# Altium schematic sheet CW308T_S6LX9_FPGAIO.SchDoc: FPGA I/O Pins, Configuration
size Letter; Organization: NewAE Technology Inc.; Address1: 1083 Queen St., Suite 196; Address2: Halifax; Address3: NS; Address4: Canada B3H 0B2; SheetNumber: 3; SheetTotal: 3; SheetApproved: Yes
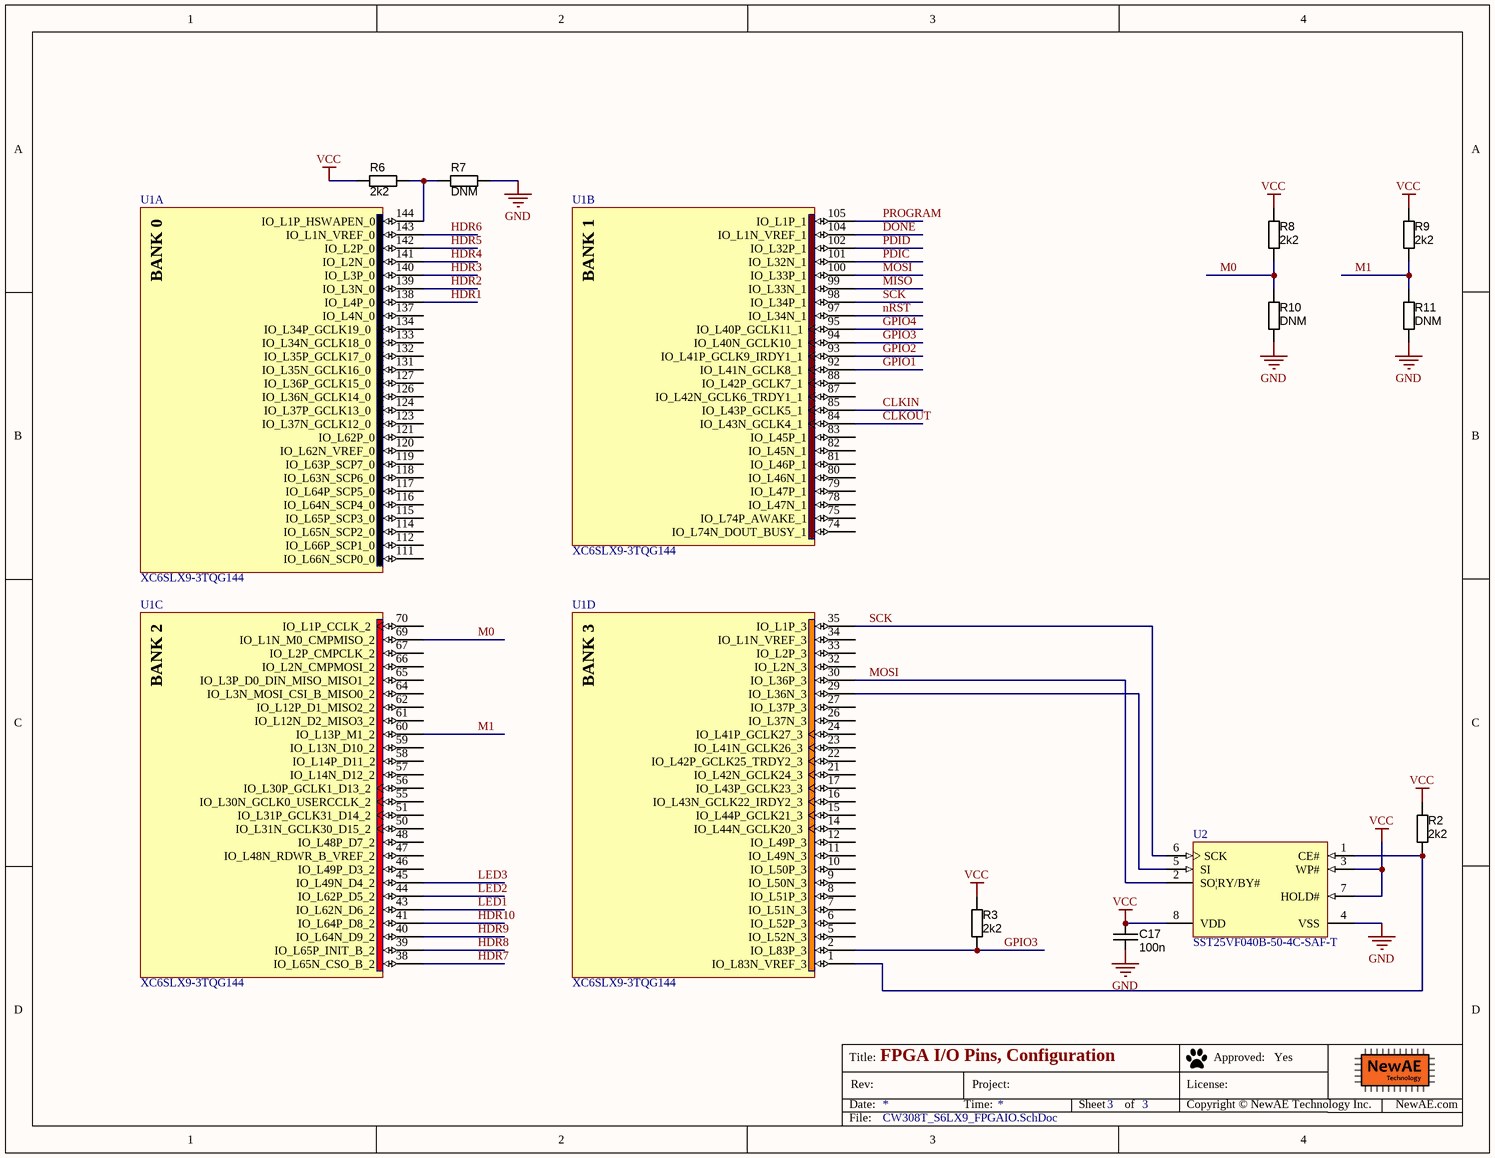
[diagram p0: CW308T_S6LX9_FPGAIO.SchDoc]

## Parts
(Parts that share a designator on the sheet are numbered #1, #2 ... from top to bottom, then left to right.)
C17  value 100n  [CAPC1608X90N]  (hidden comment: approved sub OK)
R2  value 2k2  [RESC1608X55N]  (hidden comment: Thick Film)
R3  value 2k2  [RESC1608X55N]  (hidden comment: Thick Film)
R6  value 2k2  [RESC1608X55N]  (hidden comment: Thick Film)
R7  value DNM  [RESC1608X55N]  (hidden comment: Thick Film)
R8  value 2k2  [RESC1608X55N]  (hidden comment: Thick Film)
R9  value 2k2  [RESC1608X55N]  (hidden comment: Thick Film)
R10  value DNM  [RESC1608X55N]  (hidden comment: Thick Film)
R11  value DNM  [RESC1608X55N]  (hidden comment: Thick Film)
U1#1  XC6SLX9-3TQG144  [TQG144_L]  (parts A,C,D of 7)
U1#2  XC6SLX9-3TQG144  [TQG144_L]  (part B of 7)
U2  SST25VF040B-50-4C-SAF-T  [MCHP-SOIC-SA8_N]

## Nets
GND: C17.2 R7.2 R10.1 R11.1 U2.4(VSS)
VCC: C17.1 R2.1 R3.1 R6.1 R8.2 R9.2 U2.3(WP#) U2.7(HOLD#) U2.8(VDD)
CLKIN: U1#2.85(IO_L43P_GCLK5_1)
CLKOUT: U1#2.84(IO_L43N_GCLK4_1)
DONE: U1#2.104(IO_L1N_VREF_1)
GPIO1: U1#2.92(IO_L41N_GCLK8_1)
GPIO2: U1#2.93(IO_L41P_GCLK9_IRDY1_1)
GPIO3: R3.2 U1#1.2(IO_L83P_3) U1#2.94(IO_L40N_GCLK10_1)
GPIO4: U1#2.95(IO_L40P_GCLK11_1)
HDR1: U1#1.138(IO_L4P_0)
HDR2: U1#1.139(IO_L3N_0)
HDR3: U1#1.140(IO_L3P_0)
HDR4: U1#1.141(IO_L2N_0)
HDR5: U1#1.142(IO_L2P_0)
HDR6: U1#1.143(IO_L1N_VREF_0)
HDR7: U1#1.38(IO_L65N_CSO_B_2)
HDR8: U1#1.39(IO_L65P_INIT_B_2)
HDR9: U1#1.40(IO_L64N_D9_2)
HDR10: U1#1.41(IO_L64P_D8_2)
LED1: U1#1.43(IO_L62N_D6_2)
LED2: U1#1.44(IO_L62P_D5_2)
LED3: U1#1.45(IO_L49N_D4_2)
M0: R8.1 R10.2 U1#1.69(IO_L1N_M0_CMPMISO_2)
M1: R9.1 R11.2 U1#1.60(IO_L13P_M1_2)
MISO: U1#2.99(IO_L33N_1)
MOSI: U1#1.30(IO_L36P_3) U1#2.100(IO_L33P_1) U2.2(SO|RY/BY#)
nRST: U1#2.97(IO_L34N_1)
PDIC: U1#2.101(IO_L32N_1)
PDID: U1#2.102(IO_L32P_1)
PROGRAM: U1#2.105(IO_L1P_1)
SCK: U1#1.35(IO_L1P_3) U1#2.98(IO_L34P_1) U2.6(SCK)
NetR2_2: R2.2 U1#1.1(IO_L83N_VREF_3) U2.1(CE#)
NetR6_2: R6.2 R7.1 U1#1.144(IO_L1P_HSWAPEN_0)
NetU1#1_29: U1#1.29(IO_L36N_3) U2.5(SI)

Not connected (* = marked no-connect by the designer): U1#1 5(IO_L52N_3) 6(IO_L52P_3) 7(IO_L51N_3) 8(IO_L51P_3) 9(IO_L50N_3) 10(IO_L50P_3) 11(IO_L49N_3) 12(IO_L49P_3) 14(IO_L44N_GCLK20_3) 15(IO_L44P_GCLK21_3) 16(IO_L43N_GCLK22_IRDY2_3) 17(IO_L43P_GCLK23_3) 21(IO_L42N_GCLK24_3) 22(IO_L42P_GCLK25_TRDY2_3) 23(IO_L41N_GCLK26_3) 24(IO_L41P_GCLK27_3) 26(IO_L37N_3) 27(IO_L37P_3) 32(IO_L2N_3) 33(IO_L2P_3) 34(IO_L1N_VREF_3) 46(IO_L49P_D3_2) 47(IO_L48N_RDWR_B_VREF_2) 48(IO_L48P_D7_2) 50(IO_L31N_GCLK30_D15_2) 51(IO_L31P_GCLK31_D14_2) 55(IO_L30N_GCLK0_USERCCLK_2) 56(IO_L30P_GCLK1_D13_2) 57(IO_L14N_D12_2) 58(IO_L14P_D11_2) 59(IO_L13N_D10_2) 61(IO_L12N_D2_MISO3_2) 62(IO_L12P_D1_MISO2_2) 64(IO_L3N_MOSI_CSI_B_MISO0_2) 65(IO_L3P_D0_DIN_MISO_MISO1_2) 66(IO_L2N_CMPMOSI_2) 67(IO_L2P_CMPCLK_2) 70(IO_L1P_CCLK_2) 111(IO_L66N_SCP0_0) 112(IO_L66P_SCP1_0) 114(IO_L65N_SCP2_0) 115(IO_L65P_SCP3_0) 116(IO_L64N_SCP4_0) 117(IO_L64P_SCP5_0) 118(IO_L63N_SCP6_0) 119(IO_L63P_SCP7_0) 120(IO_L62N_VREF_0) 121(IO_L62P_0) 123(IO_L37N_GCLK12_0) 124(IO_L37P_GCLK13_0) 126(IO_L36N_GCLK14_0) 127(IO_L36P_GCLK15_0) 131(IO_L35N_GCLK16_0) 132(IO_L35P_GCLK17_0) 133(IO_L34N_GCLK18_0) 134(IO_L34P_GCLK19_0) 137(IO_L4N_0); U1#2 74(IO_L74N_DOUT_BUSY_1) 75(IO_L74P_AWAKE_1) 78(IO_L47N_1) 79(IO_L47P_1) 80(IO_L46N_1) 81(IO_L46P_1) 82(IO_L45N_1) 83(IO_L45P_1) 87(IO_L42N_GCLK6_TRDY1_1) 88(IO_L42P_GCLK7_1)

## Notes on the sheet
- Title:
- Date:
- Rev:
- Time:
- Project:
- Sheet
- of
- License:
- Copyright © NewAE Technology Inc.
- Approved:
- NewAE.com
- File:
- (in symbol CMP-0068-00084-1, part A) BANK 0
- (in symbol CMP-0068-00084-1, part B) BANK 1
- (in symbol CMP-0068-00084-1, part C) BANK 2
- (in symbol CMP-0068-00084-1, part D) BANK 3

## Library data of the parts
C17 = CAPC_100n_0603_X7R_50V_10%: Capacitor SMD Cer 100nF 10% 50V X7R 0603; Manufacturer 1: AVX Corporation; Manufacturer Part Number 1: 06035C104KAT2A; Ratings: 50V; X7R; Material: ceramic; SCDType: spec; Manufacturer 2: TDK Corporation; Manufacturer Part Number 2: C1608X7R1H104K; Package / Case: 0603 (1608 Metric); Tolerance: ±10%; Supplier 1: Digi-Key; Supplier Part Number 1: 478-5052-1-ND; ComponentLink1URL: http://www.avx.com/docs/Catalogs/cx7r.pdf; ComponentLink1Description: http://www.avx.com/docs/Catalogs/cx7r.pdf; Supplier 2: Digi-Key; Supplier Part Number 2: 445-1314-1-ND; ComponentLink2URL: http://product.tdk.com/capacitor/mlcc/en/documents/mlcc_commercial_general_en.pdf; ComponentLink2Description: http://product.tdk.com/capacitor/mlcc/en/documents/mlcc_commercial_general_en.pdf
R2 R3 R6-R11 = RES_1K_0603_5%: Resistor SMD chip 1k Ohm 0.1W 5% 0603; Manufacturer 1: Yageo; Manufacturer Part Number 1: RC0603JR-071KL; Ratings: 1/10 W; SCDType: spec; Package / Case: 0603 (1608 metric); Tolerance: ±5%; Material: Thick Film; Supplier 1: Digi-Key; Supplier Part Number 1: 311-1.0KGRCT-ND; Supplier 2: Digi-Key; Supplier Part Number 2: 541-1.0KGCT-ND; Manufacturer 2: Vishay Dale; Manufacturer Part Number 2: CRCW06031K00JNEA; ComponentLink2URL: http://www.vishay.com/doc?20008; ComponentLink2Description: http://www.vishay.com/doc?20008; ComponentLink1URL: http://www.yageo.com/documents/recent/PYu-RC0603_51_RoHS_L_4.pdf; ComponentLink1Description: http://www.yageo.com/documents/recent/PYu-RC0603_51_RoHS_L_4.pdf
U1#1 U1#2 = CMP-0068-00084-1: Spartan-6 LX 1.0V FPGA, 102 User I/Os, 144-Pin TQFP (0.5mm Pitch), Low Power Version, Commercial Grade, Pb-Free; PackageDescription: 144-Pin Thin Quad Flat Pack (TQG144) - Pb-Free; DatasheetVersion: ver1.6, Nov-2010; PackageReference: TQG144; PackageVersion: ver1.2, Jun-2004; Code_JEDEC: MS-026-BFB; PartId: 1
U2 = CMP-0378-00095-1: 4 Mbit SPI Serial Flash, 2.7 to 3.6 V, 50 MHz, 0 to 70 degC, 8-pin SOIC (SA8), Tape and Reel; Manufacturer: Microchip; DatasheetVersion: Rev. A; ComponentLink1Description: Manufacturer URL; ComponentLink3URL: http://ww1.microchip.com/downloads/en/DeviceDoc/25080A.pdf; ComponentLink2URL: http://ww1.microchip.com/downloads/en/DeviceDoc/25051A.pdf; PackageReference: SOIC-SA8; PackageVersion: Rev. A; ComponentLink1URL: http://www.microchip.com; PartNumber: SST25VF040B-50-4C-SAF-T; PackageDescription: 8-Lead Plastic Small Outline, 4.9 x 3.9 mm Body, 1.27 mm Pitch; ComponentLink2Description: Datasheet; Mounting Technology: Surface Mount; ComponentLink4Description: Product URL; ComponentLink3Description: Package Specification; Code_JEDEC: MS-012; ComponentLink4URL: http://www.microchip.com/SST25VF040B